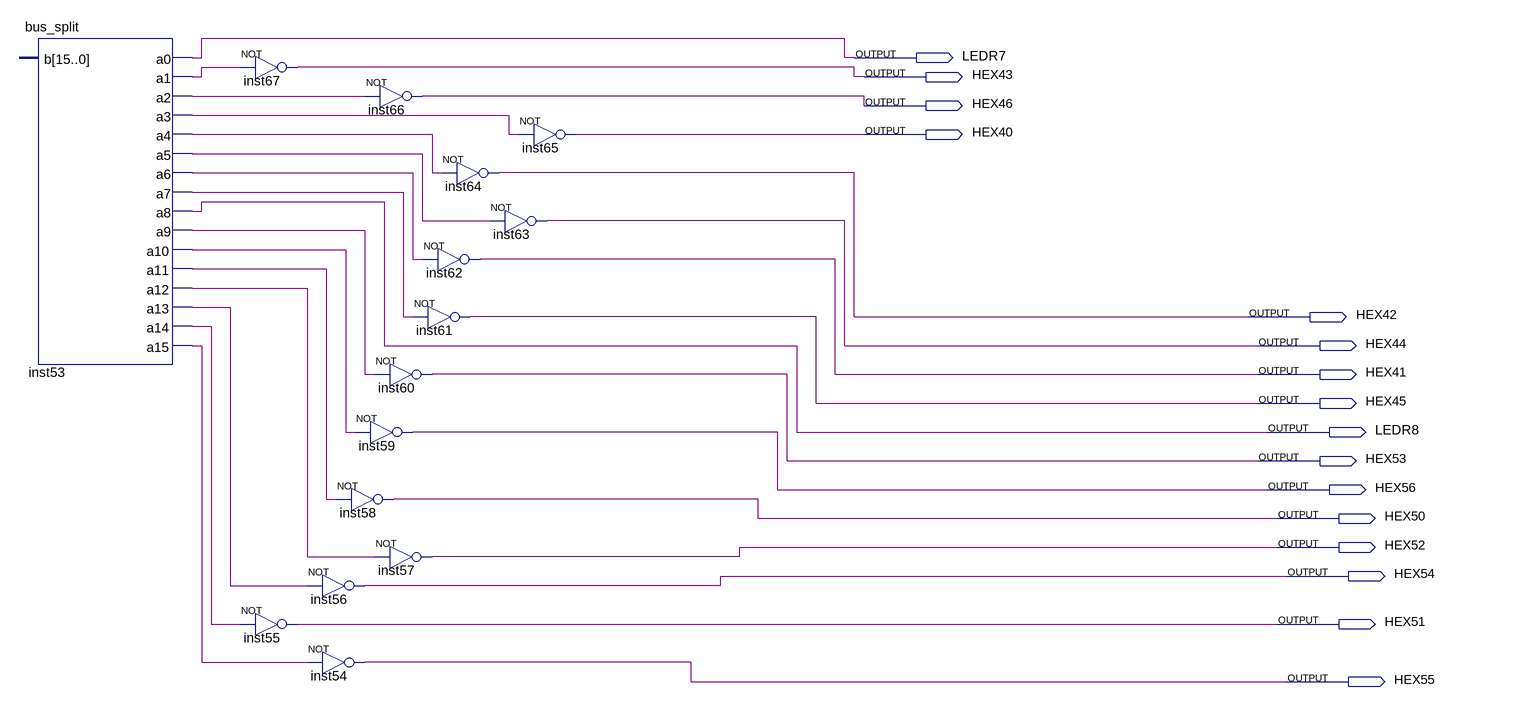
[diagram p0: schematic sheet]
// Quartus schematic display2.bdf as structural Verilog: 15 symbols, 16 pins
module display2 (
  output LEDR7,
  output HEX43,
  output HEX46,
  output HEX40,
  output HEX42,
  output HEX44,
  output HEX41,
  output HEX45,
  output LEDR8,
  output HEX53,
  output HEX56,
  output HEX50,
  output HEX52,
  output HEX54,
  output HEX51,
  output HEX55
);

  wire inst53_a1, inst53_a2, inst53_a3, inst53_a4, inst53_a5, inst53_a6, inst53_a7, inst53_a9, inst53_a10,
       inst53_a11, inst53_a12, inst53_a13, inst53_a14, inst53_a15;

  bus_split inst53 (
    .a0(LEDR7), .a1(inst53_a1), .a2(inst53_a2), .a3(inst53_a3), .a4(inst53_a4), .a5(inst53_a5),
    .a6(inst53_a6), .a7(inst53_a7), .a8(LEDR8), .a9(inst53_a9), .a10(inst53_a10), .a11(inst53_a11),
    .a12(inst53_a12), .a13(inst53_a13), .a14(inst53_a14), .a15(inst53_a15));  // open: b
  not inst67 (HEX43, inst53_a1);
  not inst55 (HEX51, inst53_a14);
  not inst58 (HEX50, inst53_a11);
  not inst56 (HEX54, inst53_a13);
  not inst54 (HEX55, inst53_a15);
  not inst66 (HEX46, inst53_a2);
  not inst61 (HEX45, inst53_a7);
  not inst60 (HEX53, inst53_a9);
  not inst59 (HEX56, inst53_a10);
  not inst57 (HEX52, inst53_a12);
  not inst64 (HEX42, inst53_a4);
  not inst63 (HEX44, inst53_a5);
  not inst62 (HEX41, inst53_a6);
  not inst65 (HEX40, inst53_a3);
endmodule
